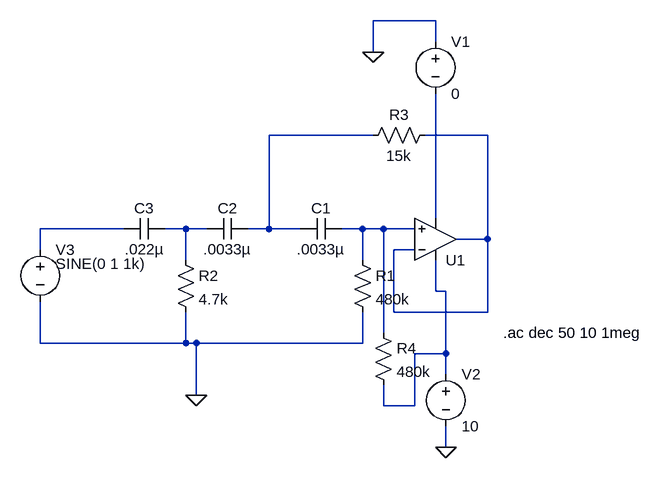
[diagram p0: schematic ThirdHigh.asc]
ThirdHigh.asc, the LTspice schematic file:
Version 4
SHEET 1 916 680
WIRE 592 0 496 0
WIRE 592 32 592 0
WIRE 496 48 496 0
WIRE 496 176 336 176
WIRE 672 176 576 176
WIRE 592 304 592 112
WIRE 112 320 -16 320
WIRE 208 320 176 320
WIRE 240 320 208 320
WIRE 336 320 336 176
WIRE 336 320 304 320
WIRE 384 320 336 320
WIRE 480 320 448 320
WIRE 512 320 480 320
WIRE 560 320 512 320
WIRE 672 336 672 176
WIRE 672 336 624 336
WIRE -16 352 -16 320
WIRE 560 352 528 352
WIRE 208 368 208 320
WIRE 480 368 480 320
WIRE 592 416 592 368
WIRE 608 416 592 416
WIRE 528 448 528 352
WIRE 672 448 672 336
WIRE 672 448 528 448
WIRE 512 480 512 320
WIRE -16 496 -16 432
WIRE 208 496 208 448
WIRE 208 496 -16 496
WIRE 224 496 208 496
WIRE 480 496 480 448
WIRE 480 496 224 496
WIRE 608 512 608 416
WIRE 608 512 560 512
WIRE 608 544 608 512
WIRE 224 576 224 496
WIRE 512 592 512 560
WIRE 560 592 560 512
WIRE 560 592 512 592
WIRE 608 656 608 624
FLAG 224 576 0
FLAG 608 656 0
FLAG 496 48 0
SYMBOL Opamps/UniversalOpamp2 592 336 M180
SYMATTR InstName U1
SYMBOL cap 448 304 R90
WINDOW 0 0 32 VBottom 2
WINDOW 3 32 32 VTop 2
SYMATTR InstName C1
SYMATTR Value .0033µ
SYMBOL cap 304 304 R90
WINDOW 0 0 32 VBottom 2
WINDOW 3 32 32 VTop 2
SYMATTR InstName C2
SYMATTR Value .0033µ
SYMBOL cap 176 304 R90
WINDOW 0 0 32 VBottom 2
WINDOW 3 32 32 VTop 2
SYMATTR InstName C3
SYMATTR Value .022µ
SYMBOL res 464 352 R0
SYMATTR InstName R1
SYMATTR Value 480k
SYMBOL res 192 352 R0
SYMATTR InstName R2
SYMATTR Value 4.7k
SYMBOL res 592 160 R90
WINDOW 0 0 56 VBottom 2
WINDOW 3 32 56 VTop 2
SYMATTR InstName R3
SYMATTR Value 15k
SYMBOL voltage 592 16 R0
SYMATTR InstName V1
SYMATTR Value 0
SYMBOL voltage 608 528 R0
SYMATTR InstName V2
SYMATTR Value 10
SYMBOL voltage -16 336 R0
WINDOW 3 24 38 Left 2
SYMATTR Value SINE(0 1 1k)
SYMATTR InstName V3
SYMATTR Value2 AC 1
SYMBOL res 496 464 R0
SYMATTR InstName R4
SYMATTR Value 480k
TEXT 696 480 Left 2 !.ac dec 50 10 1meg

The netlist it stands for:
* ThirdHigh.asc
XU1 N006 N002 N007 N003 N002 level.2 Avol=1Meg GBW=10Meg Slew=10Meg ilimit=25m rail=0 Vos=0 phimargin=45 en=0 enk=0 in=0 ink=0 Rin=500Meg  ; pins IN+ IN- V+ V- OUT
C1 N006 N001 .0033µ
C2 N001 N005 .0033µ
C3 N005 N004 .022µ
R1 N006 0 480k
R2 N005 0 4.7k
R3 N002 N001 15k
V1 0 N003 0
V2 N007 0 10
V3 N004 0 SINE(0 1 1k) AC 1
R4 N006 N007 480k
.ac dec 50 10 1meg
.lib UniversalOpamps2.sub
.backanno
.end